# EasyEDA schematic Analog Clock Schematic.json
TITLE: Analog Clock 01; REV: 1.0; Date: 2023-10-14; Sheet: 1/1; Company: Resinchem Tech
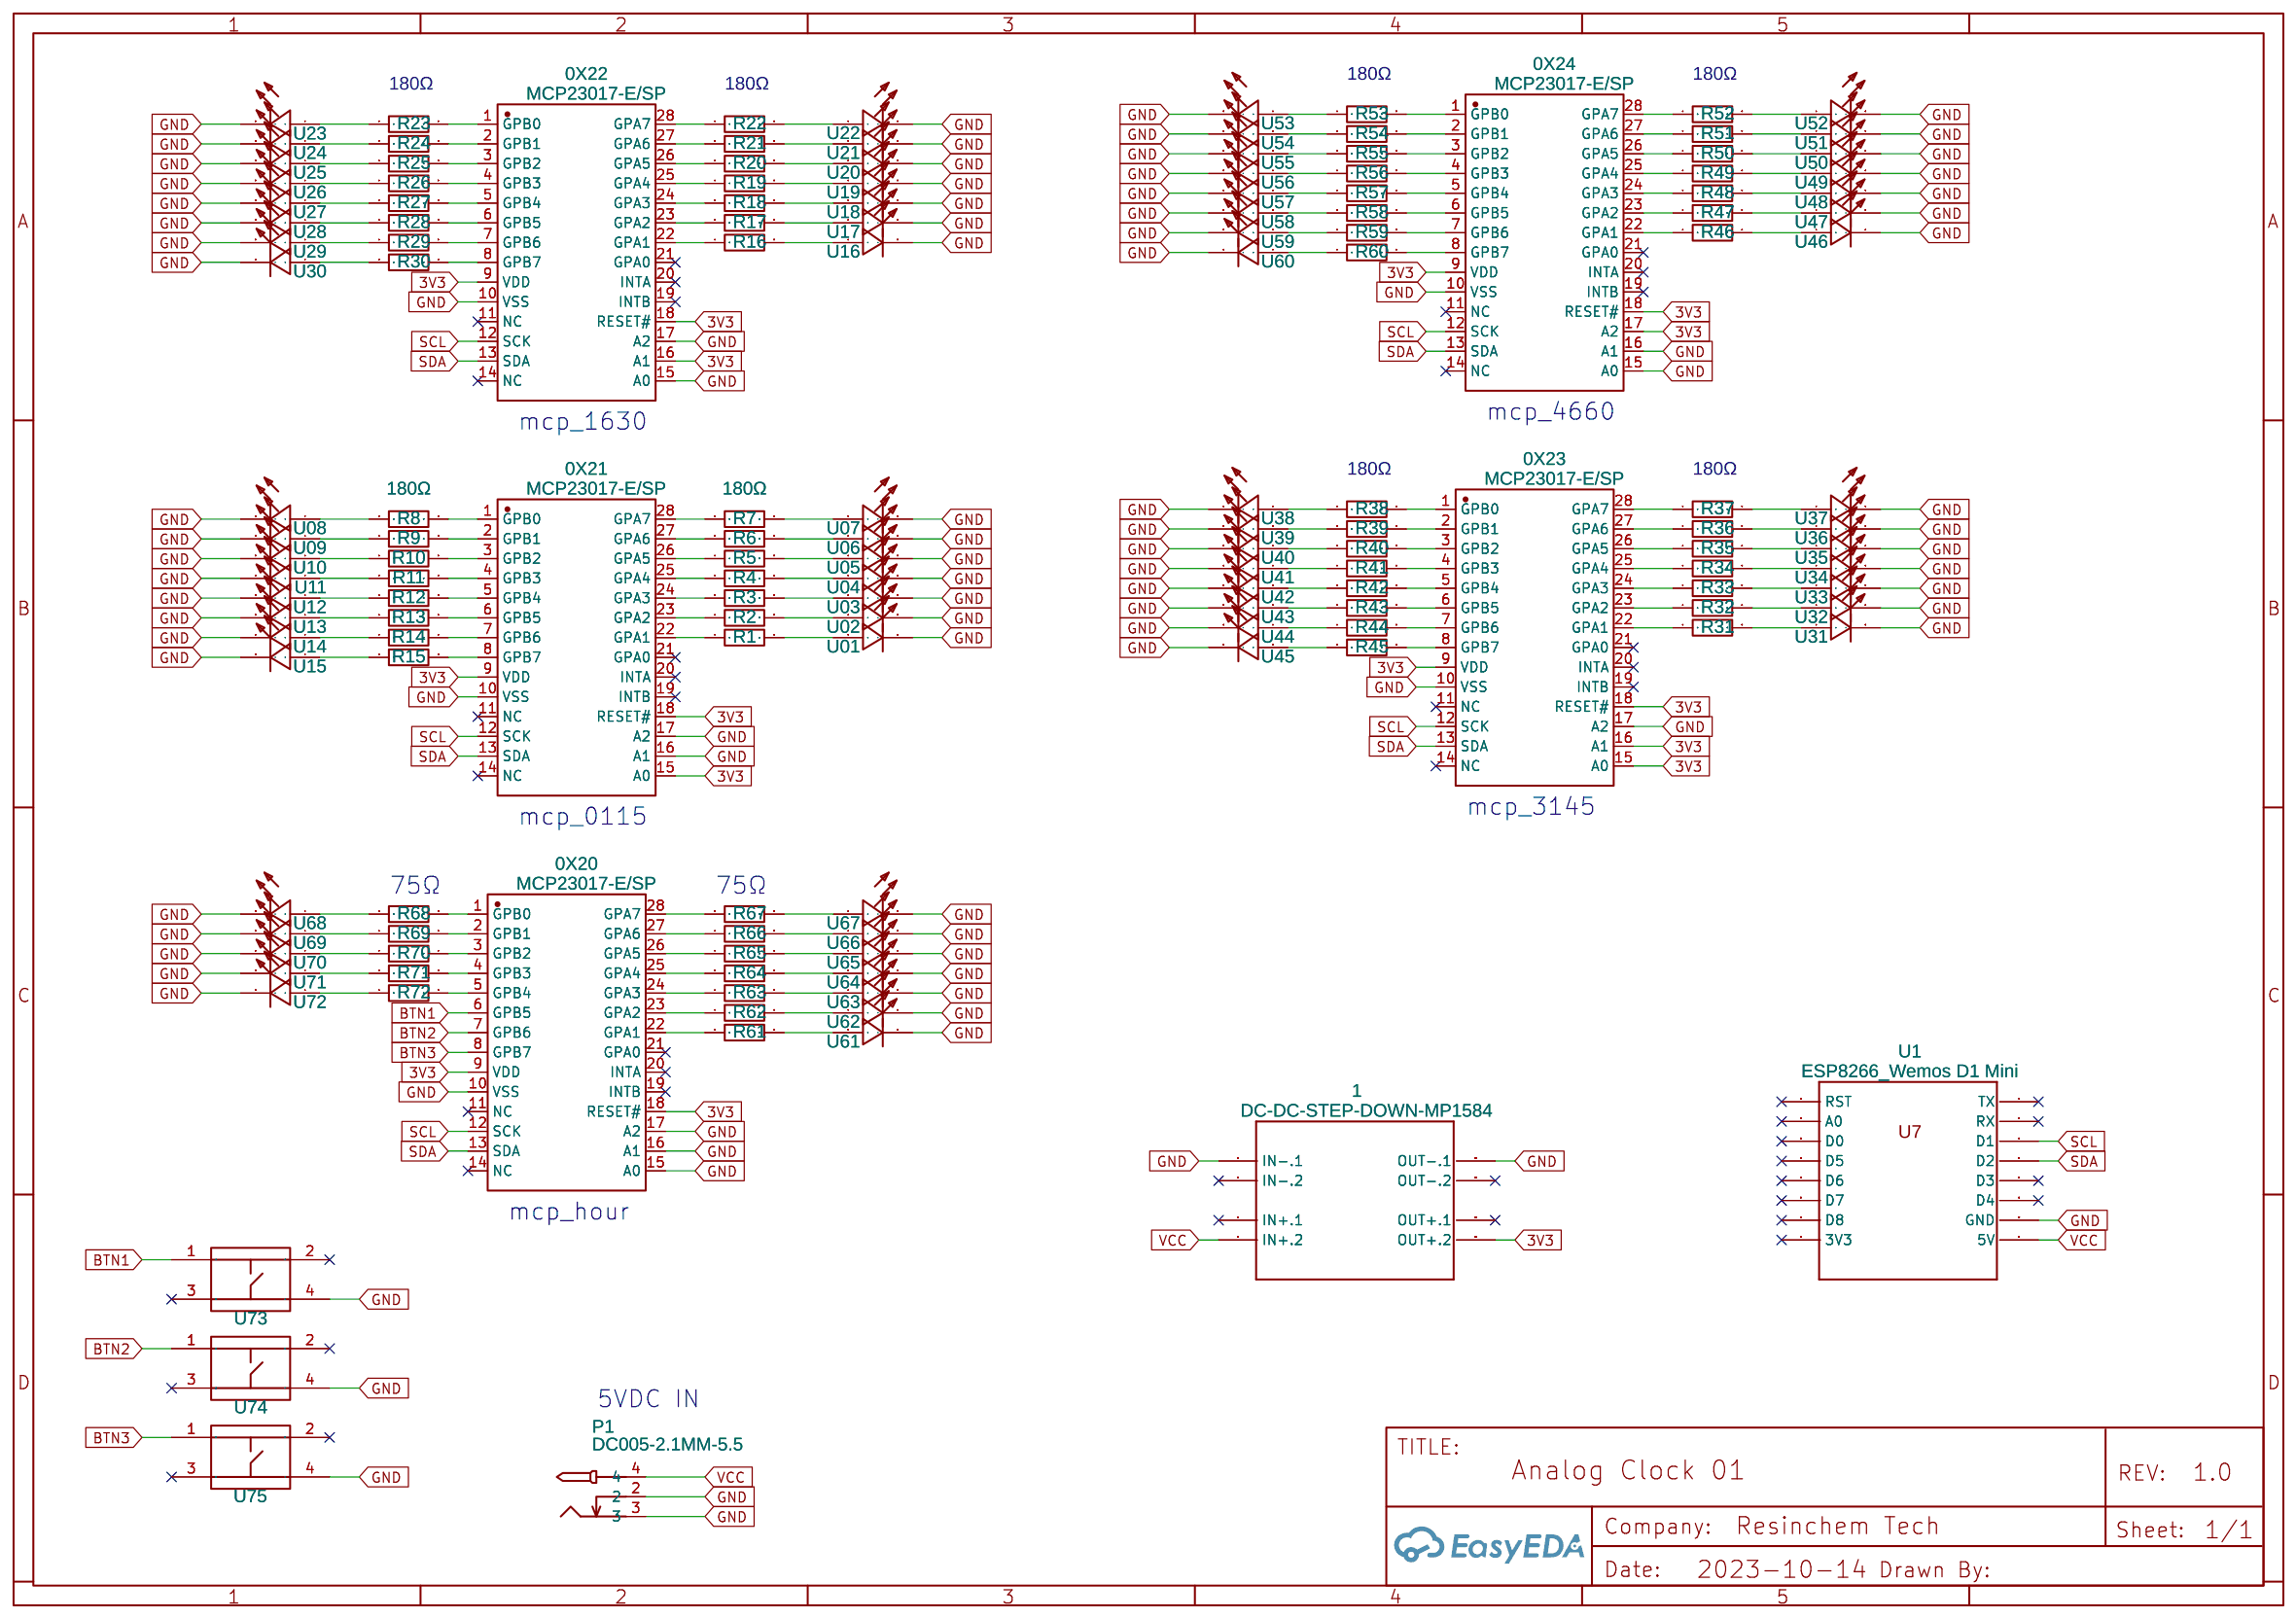
[diagram p0: schematic sheet]

## Parts
0X20  MCP23017-E/SP  [DIP-28_L34.6-W7.3-P2.54-LS10.2-BL]
0X21  MCP23017-E/SP  [DIP-28_L34.6-W7.3-P2.54-LS10.2-BL]
0X22  MCP23017-E/SP  [DIP-28_L34.6-W7.3-P2.54-LS10.2-BL]
0X23  MCP23017-E/SP  [DIP-28_L34.6-W7.3-P2.54-LS10.2-BL]
0X24  MCP23017-E/SP  [DIP-28_L34.6-W7.3-P2.54-LS10.2-BL]
1  DC-DC-STEP-DOWN-MP1584  [DC-DC-STEP-DOWN-MP1584]
P1  DC005-2.1MM-5.5  [DC005-2.1MM CP]
R1  180Ω  [PS-RES-7.5*3.6]
R2  180Ω  [PS-RES-7.5*3.6]
R3  180Ω  [PS-RES-7.5*3.6]
R4  180Ω  [PS-RES-7.5*3.6]
R5  180Ω  [PS-RES-7.5*3.6]
R6  180Ω  [PS-RES-7.5*3.6]
R7  180Ω  [PS-RES-7.5*3.6]
R8  180Ω  [PS-RES-7.5*3.6]
R9  180Ω  [PS-RES-7.5*3.6]
R10  180Ω  [PS-RES-7.5*3.6]
R11  180Ω  [PS-RES-7.5*3.6]
R12  180Ω  [PS-RES-7.5*3.6]
R13  180Ω  [PS-RES-7.5*3.6]
R14  180Ω  [PS-RES-7.5*3.6]
R15  180Ω  [PS-RES-7.5*3.6]
R16  180Ω  [PS-RES-7.5*3.6]
R17  180Ω  [PS-RES-7.5*3.6]
R18  180Ω  [PS-RES-7.5*3.6]
R19  180Ω  [PS-RES-7.5*3.6]
R20  180Ω  [PS-RES-7.5*3.6]
R21  180Ω  [PS-RES-7.5*3.6]
R22  180Ω  [PS-RES-7.5*3.6]
R23  180Ω  [PS-RES-7.5*3.6]
R24  180Ω  [PS-RES-7.5*3.6]
R25  180Ω  [PS-RES-7.5*3.6]
R26  180Ω  [PS-RES-7.5*3.6]
R27  180Ω  [PS-RES-7.5*3.6]
R28  180Ω  [PS-RES-7.5*3.6]
R29  180Ω  [PS-RES-7.5*3.6]
R30  180Ω  [PS-RES-7.5*3.6]
R31  180Ω  [PS-RES-7.5*3.6]
R32  180Ω  [PS-RES-7.5*3.6]
R33  180Ω  [PS-RES-7.5*3.6]
R34  180Ω  [PS-RES-7.5*3.6]
R35  180Ω  [PS-RES-7.5*3.6]
R36  180Ω  [PS-RES-7.5*3.6]
R37  180Ω  [PS-RES-7.5*3.6]
R38  180Ω  [PS-RES-7.5*3.6]
R39  180Ω  [PS-RES-7.5*3.6]
R40  180Ω  [PS-RES-7.5*3.6]
R41  180Ω  [PS-RES-7.5*3.6]
R42  180Ω  [PS-RES-7.5*3.6]
R43  180Ω  [PS-RES-7.5*3.6]
R44  180Ω  [PS-RES-7.5*3.6]
R45  180Ω  [PS-RES-7.5*3.6]
R46  180Ω  [PS-RES-7.5*3.6]
R47  180Ω  [PS-RES-7.5*3.6]
R48  180Ω  [PS-RES-7.5*3.6]
R49  180Ω  [PS-RES-7.5*3.6]
R50  180Ω  [PS-RES-7.5*3.6]
R51  180Ω  [PS-RES-7.5*3.6]
R52  180Ω  [PS-RES-7.5*3.6]
R53  180Ω  [PS-RES-7.5*3.6]
R54  180Ω  [PS-RES-7.5*3.6]
R55  180Ω  [PS-RES-7.5*3.6]
R56  180Ω  [PS-RES-7.5*3.6]
R57  180Ω  [PS-RES-7.5*3.6]
R58  180Ω  [PS-RES-7.5*3.6]
R59  180Ω  [PS-RES-7.5*3.6]
R60  180Ω  [PS-RES-7.5*3.6]
R61  56Ω  [PS-RES-7.5*3.6]
R62  56Ω  [PS-RES-7.5*3.6]
R63  56Ω  [PS-RES-7.5*3.6]
R64  56Ω  [PS-RES-7.5*3.6]
R65  56Ω  [PS-RES-7.5*3.6]
R66  56Ω  [PS-RES-7.5*3.6]
R67  56Ω  [PS-RES-7.5*3.6]
R68  56Ω  [PS-RES-7.5*3.6]
R69  56Ω  [PS-RES-7.5*3.6]
R70  56Ω  [PS-RES-7.5*3.6]
R71  56Ω  [PS-RES-7.5*3.6]
R72  56Ω  [PS-RES-7.5*3.6]
U01  NO  [LED-3MM/2.54]
U02  NO  [LED-3MM/2.54]
U03  NO  [LED-3MM/2.54]
U04  NO  [LED-3MM/2.54]
U05  NO  [LED-3MM/2.54]
U06  NO  [LED-3MM/2.54]
U07  NO  [LED-3MM/2.54]
U08  NO  [LED-3MM/2.54]
U09  NO  [LED-3MM/2.54]
U10  NO  [LED-3MM/2.54]
U11  NO  [LED-3MM/2.54]
U12  NO  [LED-3MM/2.54]
U13  NO  [LED-3MM/2.54]
U14  NO  [LED-3MM/2.54]
U15  NO  [LED-3MM/2.54]
U16  NO  [LED-3MM/2.54]
U17  NO  [LED-3MM/2.54]
U18  NO  [LED-3MM/2.54]
U19  NO  [LED-3MM/2.54]
U20  NO  [LED-3MM/2.54]
U21  NO  [LED-3MM/2.54]
U22  NO  [LED-3MM/2.54]
U23  NO  [LED-3MM/2.54]
U24  NO  [LED-3MM/2.54]
U25  NO  [LED-3MM/2.54]
U26  NO  [LED-3MM/2.54]
U27  NO  [LED-3MM/2.54]
U28  NO  [LED-3MM/2.54]
U29  NO  [LED-3MM/2.54]
U30  NO  [LED-3MM/2.54]
U31  NO  [LED-3MM/2.54]
U32  NO  [LED-3MM/2.54]
U33  NO  [LED-3MM/2.54]
U34  NO  [LED-3MM/2.54]
U35  NO  [LED-3MM/2.54]
U36  NO  [LED-3MM/2.54]
U37  NO  [LED-3MM/2.54]
U38  NO  [LED-3MM/2.54]
U39  NO  [LED-3MM/2.54]
U40  NO  [LED-3MM/2.54]
U41  NO  [LED-3MM/2.54]
U42  NO  [LED-3MM/2.54]
U43  NO  [LED-3MM/2.54]
U44  NO  [LED-3MM/2.54]
U45  NO  [LED-3MM/2.54]
U46  NO  [LED-3MM/2.54]
U47  NO  [LED-3MM/2.54]
U48  NO  [LED-3MM/2.54]
U49  NO  [LED-3MM/2.54]
U50  NO  [LED-3MM/2.54]
U51  NO  [LED-3MM/2.54]
U52  NO  [LED-3MM/2.54]
U53  NO  [LED-3MM/2.54]
U54  NO  [LED-3MM/2.54]
U55  NO  [LED-3MM/2.54]
U56  NO  [LED-3MM/2.54]
U57  NO  [LED-3MM/2.54]
U58  NO  [LED-3MM/2.54]
U59  NO  [LED-3MM/2.54]
U60  NO  [LED-3MM/2.54]
U61  NO  [LED-3MM/2.54]
U62  NO  [LED-3MM/2.54]
U63  NO  [LED-3MM/2.54]
U64  NO  [LED-3MM/2.54]
U65  NO  [LED-3MM/2.54]
U66  NO  [LED-3MM/2.54]
U67  NO  [LED-3MM/2.54]
U68  NO  [LED-3MM/2.54]
U69  NO  [LED-3MM/2.54]
U70  NO  [LED-3MM/2.54]
U71  NO  [LED-3MM/2.54]
U72  NO  [LED-3MM/2.54]
U73  NO  [DIP-6*6*7.5]
U74  NO  [DIP-6*6*7.5]
U75  NO  [DIP-6*6*7.5]

## Library data of the parts
0X20-0X24 = MCP23017-E/SP: Contributor: LCSC; Supplier: LCSC; Supplier Part: C647352; Manufacturer: MICROCHIP(美国微芯); JLCPCB Part Class: Extended Part; link: https://lcsc.com/eda_search?q=C647352&%26type=1&ref=editor
1 = DC-DC-STEP-DOWN-MP1584: Contributor: Otto Sonneveld
P1 = DC005-2.1MM-5.5: Supplier Part: C68942; Supplier: LCSC; Manufacturer: LCSC; Manufacturer Part: DC005-2.1MM
R1-R72 = EWWR0008J180RT9: Contributor: LCSC; Supplier: LCSC; Supplier Part: C349021; Manufacturer: RESI(开步睿思）; JLCPCB Part Class: Extended Part; link: https://lcsc.com/eda_search?q=C349021&%26type=1&ref=editor
U01 U02 U03 U04 U05 U06 U07 U08 U09-U72 = LED-3MM: Supplier: LCSC; Manufacturer: EVERLIGHT; Manufacturer Part: 204-10SURD/S530-A3; Supplier Part: C99772
U73-U75 = PUSHBUTTON, THROUGH HOLE, 4.5MM X 6.5MM: Supplier Part: C110153; Supplier: LCSC; Manufacturer: HRO; Manufacturer Part: K2-1102DP-C4SW-04; Contributor: LCSC

## Nets
3V3: 0X20.9(VDD) 0X20.18(RESET#) 0X21.9(VDD) 0X21.15(A0) 0X21.18(RESET#) 0X22.9(VDD) 0X22.16(A1) 0X22.18(RESET#) 0X23.9(VDD) 0X23.15(A0) 0X23.16(A1) 0X23.18(RESET#) 0X24.9(VDD) 0X24.17(A2) 0X24.18(RESET#) 1.OUT+.2
GND: 0X20.10(VSS) 0X20.15(A0) 0X20.16(A1) 0X20.17(A2) 0X21.10(VSS) 0X21.16(A1) 0X21.17(A2) 0X22.10(VSS) 0X22.15(A0) 0X22.17(A2) 0X23.10(VSS) 0X23.17(A2) 0X24.10(VSS) 0X24.15(A0) 0X24.16(A1) 1.IN-.1 1.OUT-.1 P1.2 P1.3 U01.2(-) U02.2(-) U03.2(-) U04.2(-) U05.2(-) U06.2(-) U07.2(-) U08.2(-) U09.2(-) U10.2(-) U11.2(-) U12.2(-) U13.2(-) U14.2(-) U15.2(-) U16.2(-) U17.2(-) U18.2(-) U19.2(-) U20.2(-) U21.2(-) U22.2(-) U23.2(-) U24.2(-) U25.2(-) U26.2(-) U27.2(-) U28.2(-) U29.2(-) U30.2(-) U31.2(-) U32.2(-) U33.2(-) U34.2(-) U35.2(-) U36.2(-) U37.2(-) U38.2(-) U39.2(-) U40.2(-) U41.2(-) U42.2(-) U43.2(-) U44.2(-) U45.2(-) U46.2(-) U47.2(-) U48.2(-) U49.2(-) U50.2(-) U51.2(-) U52.2(-) U53.2(-) U54.2(-) U55.2(-) U56.2(-) U57.2(-) U58.2(-) U59.2(-) U60.2(-) U61.2(-) U62.2(-) U63.2(-) U64.2(-) U65.2(-) U66.2(-) U67.2(-) U68.2(-) U69.2(-) U70.2(-) U71.2(-) U72.2(-) U73.4 U74.4 U75.4
VCC: 1.IN+.2 P1.4
BTN1: 0X20.6(GPB5) U73.1
BTN2: 0X20.7(GPB6) U74.1
BTN3: 0X20.8(GPB7) U75.1
SCL: 0X20.12(SCK) 0X21.12(SCK) 0X22.12(SCK) 0X23.12(SCK) 0X24.12(SCK)
SDA: 0X20.13(SDA) 0X21.13(SDA) 0X22.13(SDA) 0X23.13(SDA) 0X24.13(SDA)
Net-(0X20-1): 0X20.1(GPB0) R68.2
Net-(0X20-2): 0X20.2(GPB1) R69.2
Net-(0X20-3): 0X20.3(GPB2) R70.2
Net-(0X20-4): 0X20.4(GPB3) R71.2
Net-(0X20-5): 0X20.5(GPB4) R72.2
Net-(0X20-22): 0X20.22(GPA1) R61.1
Net-(0X20-23): 0X20.23(GPA2) R62.1
Net-(0X20-24): 0X20.24(GPA3) R63.1
Net-(0X20-25): 0X20.25(GPA4) R64.1
Net-(0X20-26): 0X20.26(GPA5) R65.1
Net-(0X20-27): 0X20.27(GPA6) R66.1
Net-(0X20-28): 0X20.28(GPA7) R67.1
Net-(0X21-1): 0X21.1(GPB0) R8.2
Net-(0X21-2): 0X21.2(GPB1) R9.2
Net-(0X21-3): 0X21.3(GPB2) R10.2
Net-(0X21-4): 0X21.4(GPB3) R11.2
Net-(0X21-5): 0X21.5(GPB4) R12.2
Net-(0X21-6): 0X21.6(GPB5) R13.2
Net-(0X21-7): 0X21.7(GPB6) R14.2
Net-(0X21-8): 0X21.8(GPB7) R15.2
Net-(0X21-22): 0X21.22(GPA1) R1.1
Net-(0X21-23): 0X21.23(GPA2) R2.1
Net-(0X21-24): 0X21.24(GPA3) R3.1
Net-(0X21-25): 0X21.25(GPA4) R4.1
Net-(0X21-26): 0X21.26(GPA5) R5.1
Net-(0X21-27): 0X21.27(GPA6) R6.1
Net-(0X21-28): 0X21.28(GPA7) R7.1
Net-(0X22-1): 0X22.1(GPB0) R23.2
Net-(0X22-2): 0X22.2(GPB1) R24.2
Net-(0X22-3): 0X22.3(GPB2) R25.2
Net-(0X22-4): 0X22.4(GPB3) R26.2
Net-(0X22-5): 0X22.5(GPB4) R27.2
Net-(0X22-6): 0X22.6(GPB5) R28.2
Net-(0X22-7): 0X22.7(GPB6) R29.2
Net-(0X22-8): 0X22.8(GPB7) R30.2
Net-(0X22-22): 0X22.22(GPA1) R16.1
Net-(0X22-23): 0X22.23(GPA2) R17.1
Net-(0X22-24): 0X22.24(GPA3) R18.1
Net-(0X22-25): 0X22.25(GPA4) R19.1
Net-(0X22-26): 0X22.26(GPA5) R20.1
Net-(0X22-27): 0X22.27(GPA6) R21.1
Net-(0X22-28): 0X22.28(GPA7) R22.1
Net-(0X23-1): 0X23.1(GPB0) R38.2
Net-(0X23-2): 0X23.2(GPB1) R39.2
Net-(0X23-3): 0X23.3(GPB2) R40.2
Net-(0X23-4): 0X23.4(GPB3) R41.2
Net-(0X23-5): 0X23.5(GPB4) R42.2
Net-(0X23-6): 0X23.6(GPB5) R43.2
Net-(0X23-7): 0X23.7(GPB6) R44.2
Net-(0X23-8): 0X23.8(GPB7) R45.2
Net-(0X23-22): 0X23.22(GPA1) R31.1
Net-(0X23-23): 0X23.23(GPA2) R32.1
Net-(0X23-24): 0X23.24(GPA3) R33.1
Net-(0X23-25): 0X23.25(GPA4) R34.1
Net-(0X23-26): 0X23.26(GPA5) R35.1
Net-(0X23-27): 0X23.27(GPA6) R36.1
Net-(0X23-28): 0X23.28(GPA7) R37.1
Net-(0X24-1): 0X24.1(GPB0) R53.2
Net-(0X24-2): 0X24.2(GPB1) R54.2
Net-(0X24-3): 0X24.3(GPB2) R55.2
Net-(0X24-4): 0X24.4(GPB3) R56.2
Net-(0X24-5): 0X24.5(GPB4) R57.2
Net-(0X24-6): 0X24.6(GPB5) R58.2
Net-(0X24-7): 0X24.7(GPB6) R59.2
Net-(0X24-8): 0X24.8(GPB7) R60.2
Net-(0X24-22): 0X24.22(GPA1) R46.1
Net-(0X24-23): 0X24.23(GPA2) R47.1
Net-(0X24-24): 0X24.24(GPA3) R48.1
Net-(0X24-25): 0X24.25(GPA4) R49.1
Net-(0X24-26): 0X24.26(GPA5) R50.1
Net-(0X24-27): 0X24.27(GPA6) R51.1
Net-(0X24-28): 0X24.28(GPA7) R52.1
Net-(R1-2): R1.2 U01.1(+)
Net-(R2-2): R2.2 U02.1(+)
Net-(R3-2): R3.2 U03.1(+)
Net-(R4-2): R4.2 U04.1(+)
Net-(R5-2): R5.2 U05.1(+)
Net-(R6-2): R6.2 U06.1(+)
Net-(R7-2): R7.2 U07.1(+)
Net-(R8-1): R8.1 U08.1(+)
Net-(R9-1): R9.1 U09.1(+)
Net-(R10-1): R10.1 U10.1(+)
Net-(R11-1): R11.1 U11.1(+)
Net-(R12-1): R12.1 U12.1(+)
Net-(R13-1): R13.1 U13.1(+)
Net-(R14-1): R14.1 U14.1(+)
Net-(R15-1): R15.1 U15.1(+)
Net-(R16-2): R16.2 U16.1(+)
Net-(R17-2): R17.2 U17.1(+)
Net-(R18-2): R18.2 U18.1(+)
Net-(R19-2): R19.2 U19.1(+)
Net-(R20-2): R20.2 U20.1(+)
Net-(R21-2): R21.2 U21.1(+)
Net-(R22-2): R22.2 U22.1(+)
Net-(R23-1): R23.1 U23.1(+)
Net-(R24-1): R24.1 U24.1(+)
Net-(R25-1): R25.1 U25.1(+)
Net-(R26-1): R26.1 U26.1(+)
Net-(R27-1): R27.1 U27.1(+)
Net-(R28-1): R28.1 U28.1(+)
Net-(R29-1): R29.1 U29.1(+)
Net-(R30-1): R30.1 U30.1(+)
Net-(R31-2): R31.2 U31.1(+)
Net-(R32-2): R32.2 U32.1(+)
Net-(R33-2): R33.2 U33.1(+)
Net-(R34-2): R34.2 U34.1(+)
Net-(R35-2): R35.2 U35.1(+)
Net-(R36-2): R36.2 U36.1(+)
Net-(R37-2): R37.2 U37.1(+)
Net-(R38-1): R38.1 U38.1(+)
Net-(R39-1): R39.1 U39.1(+)
Net-(R40-1): R40.1 U40.1(+)
Net-(R41-1): R41.1 U41.1(+)
Net-(R42-1): R42.1 U42.1(+)
Net-(R43-1): R43.1 U43.1(+)
Net-(R44-1): R44.1 U44.1(+)
Net-(R45-1): R45.1 U45.1(+)
Net-(R46-2): R46.2 U46.1(+)
Net-(R47-2): R47.2 U47.1(+)
Net-(R48-2): R48.2 U48.1(+)
Net-(R49-2): R49.2 U49.1(+)
Net-(R50-2): R50.2 U50.1(+)
Net-(R51-2): R51.2 U51.1(+)
Net-(R52-2): R52.2 U52.1(+)
Net-(R53-1): R53.1 U53.1(+)
Net-(R54-1): R54.1 U54.1(+)
Net-(R55-1): R55.1 U55.1(+)
Net-(R56-1): R56.1 U56.1(+)
Net-(R57-1): R57.1 U57.1(+)
Net-(R58-1): R58.1 U58.1(+)
Net-(R59-1): R59.1 U59.1(+)
Net-(R60-1): R60.1 U60.1(+)
Net-(R61-2): R61.2 U61.1(+)
Net-(R62-2): R62.2 U62.1(+)
Net-(R63-2): R63.2 U63.1(+)
Net-(R64-2): R64.2 U64.1(+)
Net-(R65-2): R65.2 U65.1(+)
Net-(R66-2): R66.2 U66.1(+)
Net-(R67-2): R67.2 U67.1(+)
Net-(R68-1): R68.1 U68.1(+)
Net-(R69-1): R69.1 U69.1(+)
Net-(R70-1): R70.1 U70.1(+)
Net-(R71-1): R71.1 U71.1(+)
Net-(R72-1): R72.1 U72.1(+)

Not connected (* = marked no-connect by the designer): 0X20 11(NC)* 14(NC)* 19(INTB)* 20(INTA)* 21(GPA0)*; 0X21 11(NC)* 14(NC)* 19(INTB)* 20(INTA)* 21(GPA0)*; 0X22 11(NC)* 14(NC)* 19(INTB)* 20(INTA)* 21(GPA0)*; 0X23 11(NC)* 14(NC)* 19(INTB)* 20(INTA)* 21(GPA0)*; 0X24 11(NC)* 14(NC)* 19(INTB)* 20(INTA)* 21(GPA0)*; 1 IN+.1* IN-.2* OUT+.1* OUT-.2*; U73 2* 3*; U74 2* 3*; U75 2* 3*

## Notes on the sheet
- 180Ω
- 180Ω
- 180Ω
- 180Ω
- mcp_1630
- mcp_4660
- 180Ω
- 180Ω
- mcp_0115
- mcp_3145
- 75Ω
- 75Ω
- mcp_hour
- 5VDC IN
